# Altium schematic sheet STC智能车.SchDoc
size A2
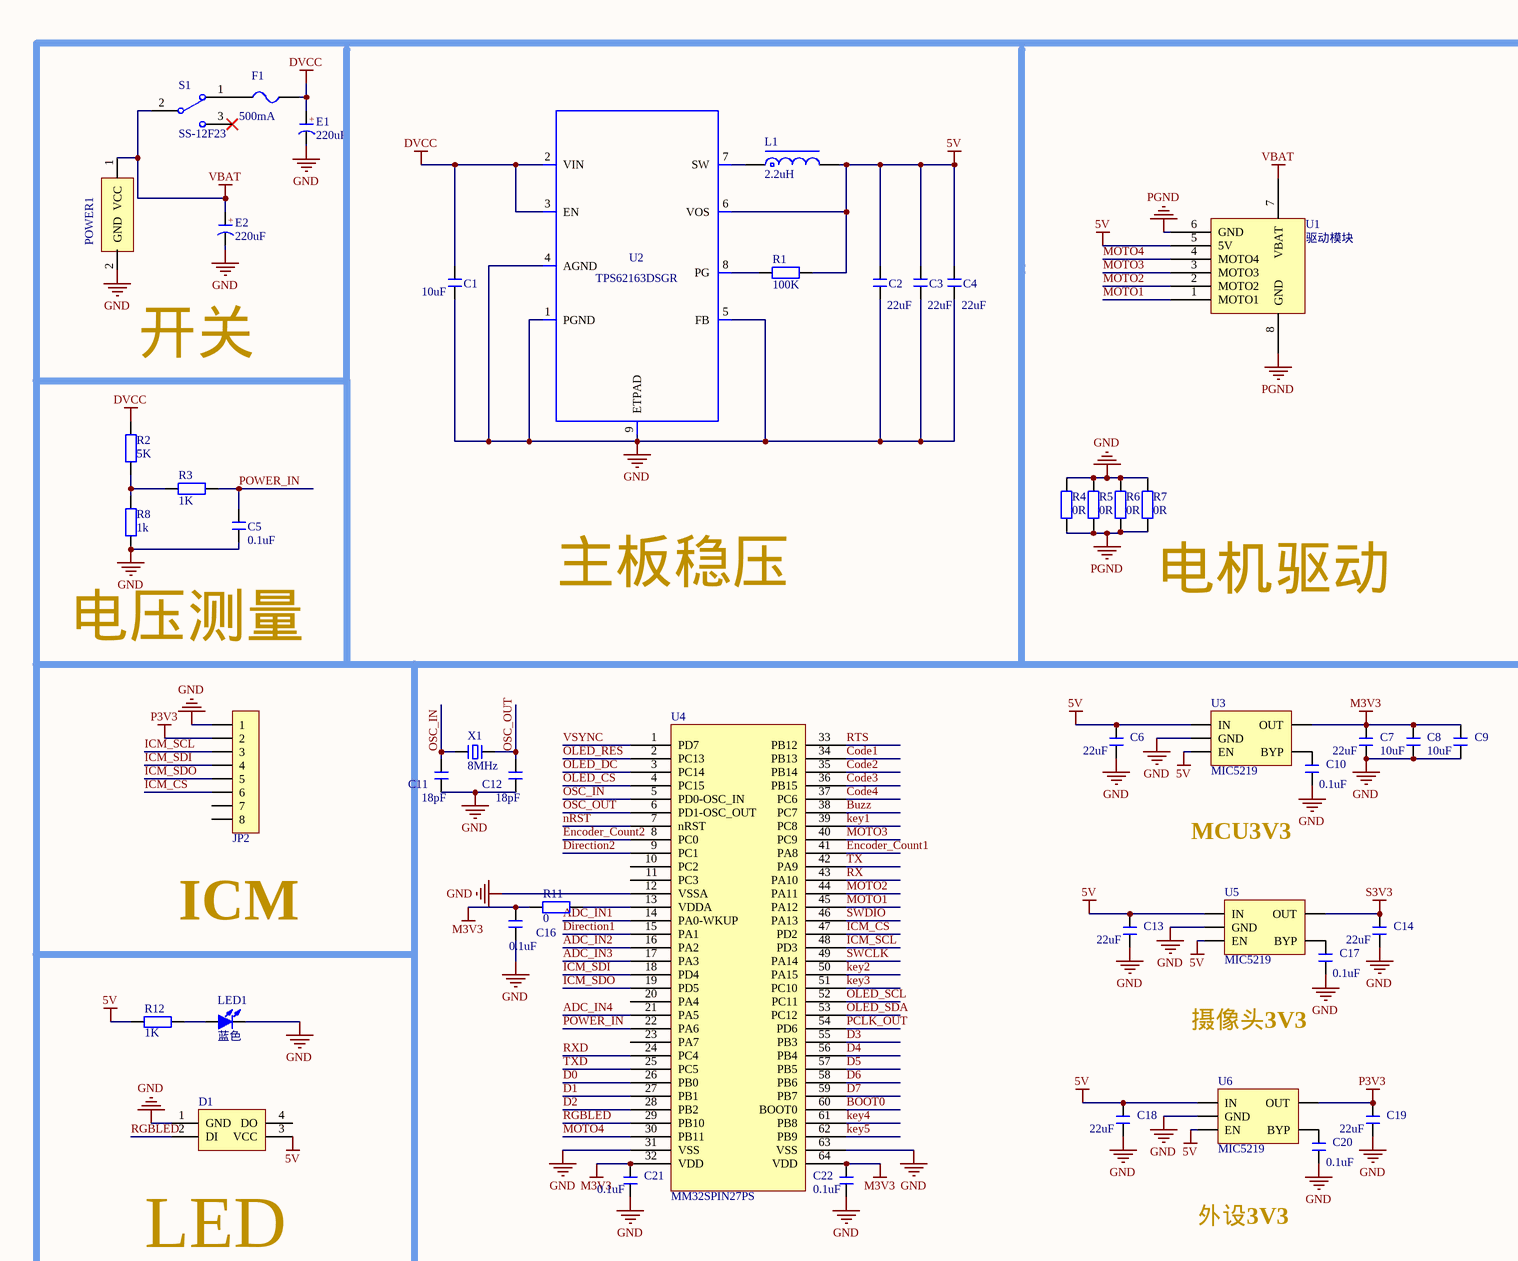
[diagram p0: STC智能车.SchDoc, top left]
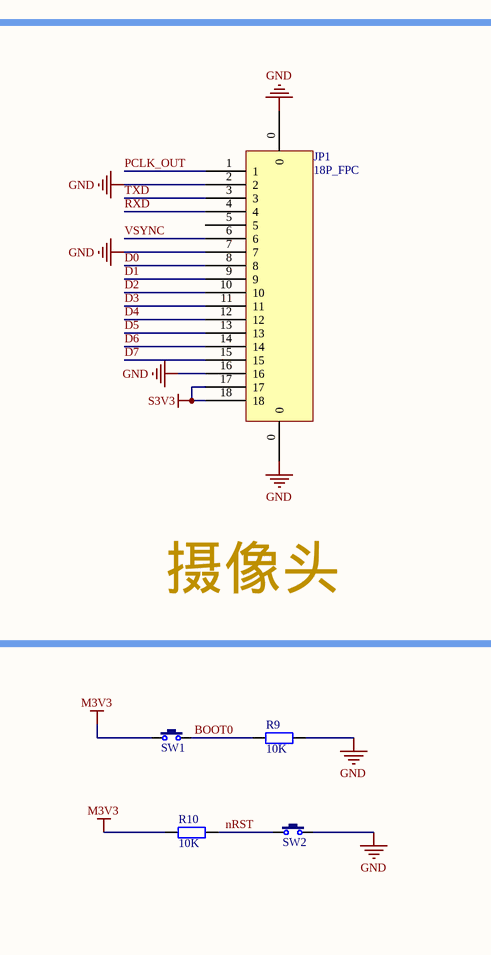
[diagram p1: STC智能车.SchDoc, top right]
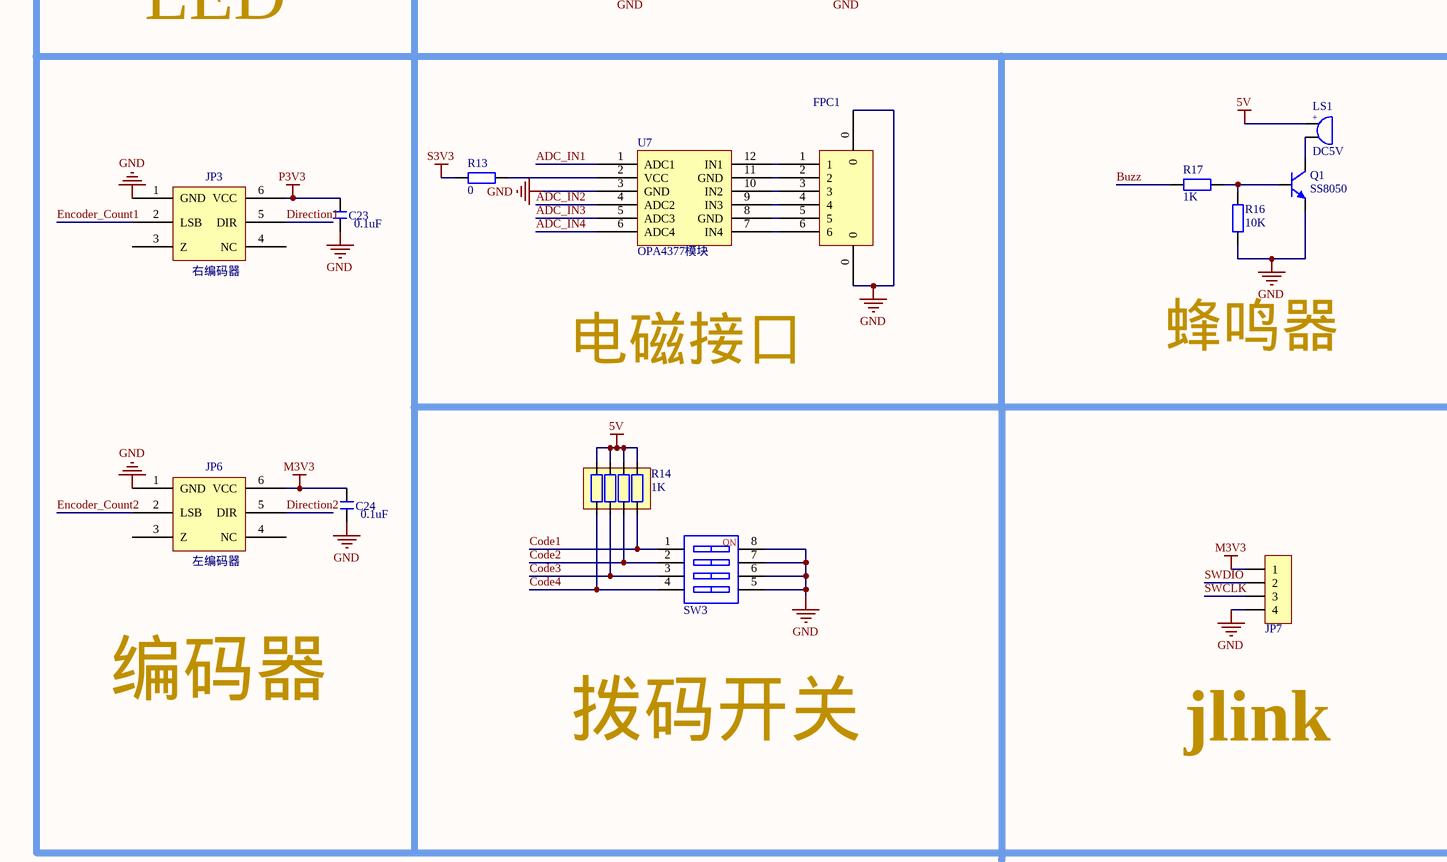
[diagram p2: STC智能车.SchDoc, bottom left]
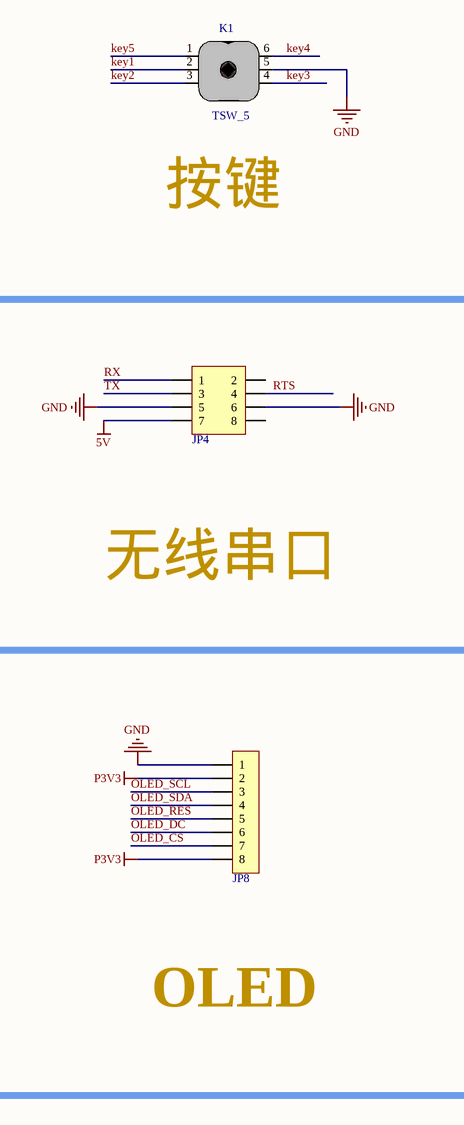
[diagram p3: STC智能车.SchDoc, bottom right]

## Parts
C1  10uF  [C 0805_M]
C2  22uF  [C 0805_M]
C3  22uF  [C 0805_M]
C4  22uF  [C 0805_M]
C5  0.1uF  [C 0805_M]
C6  22uF  [C 0805_M]
C7  22uF  [C 0805_M]
C8  10uF  [C 0805_M]
C9  10uF  [C 0805_M]
C10  0.1uF  [C 0805_M]
C11  18pF  [C 0805_M]
C12  18pF  [C 0805_M]
C13  22uF  [C 0805_M]
C14  22uF  [C 0805_M]
C16  0.1uF  [C 0805_M]
C17  0.1uF  [C 0805_M]
C18  22uF  [C 0805_M]
C19  22uF  [C 0805_M]
C20  0.1uF  [C 0805_M]
C21  0.1uF  [C 0805_M]
C22  0.1uF  [C 0805_M]
C23  0.1uF  [C 0805_M]
C24  0.1uF  [C 0805_M]
D1  P923D  [RGB_LED_5050]  (value not drawn)
E1  220uF  [CD D(7343)]
E2  220uF  [CD D(7343)]
F1  500mA  [FU 0805]
FPC1  FPC_6PIN  [FPC0.5 2H-WS-6P]  (value not drawn)
JP1  18P_FPC  [FPC0.5 2H-WS-18P]
JP2  HDR-1X8  [XH2.54-WI-8P]  (value not drawn)
JP3  右编码器  [2*3牛插座]
JP4  Header 4X2  [HDR2.54-LI-2x4P]  (value not drawn)
JP6  左编码器  [2*3牛插座]
JP7  HDR-1X4  [XH2.54-WI-4P]  (value not drawn)
JP8  HDR-1X8  [IPS]  (value not drawn)
K1  TSW_5  [TSW-10]
L1  2.2uH  [CD52]
LED1  蓝色  [LED 0805B]
LS1  DC5V  [BEEP 5x9x5.5]
POWER1  (no value)  [T槽]
Q1  SS8050  [SOT23-3N]
R1  value 100K  [R 0805_M]  (hidden comment: Res2)
R2  value 5K  [R 0805_M]  (hidden comment: Res2)
R3  value 1K  [R 0805_M]  (hidden comment: Res2)
R4  0R  [R 0805_M]
R5  0R  [R 0805_M]
R6  0R  [R 0805_M]
R7  0R  [R 0805_M]
R8  value 1k  [R 0805_M]  (hidden comment: Res2)
R9  10K  [R 0805_M]
R10  10K  [R 0805_M]
R11  0  [R 0805_M]
R12  value 1K  [R 0805_M]  (hidden comment: Res2)
R13  0  [R 0805_L]
R14  1K  [RCA-8P4R-0603]
R16  10K  [R 0805_L]
R17  1K  [R 0805_L]
S1  SS-12F23  [SS-12D10]
SW1  3x6x5  [TSW SMD-3*6*2.5]  (value not drawn)
SW2  3x6x5  [TSW SMD-3*6*2.5]  (value not drawn)
SW3  SW-4P  [CSW DIP-4P]  (value not drawn)
U1  驱动模块  [电机驱动]
U2  TPS62163DSGR  [TPS62163]
U3  MIC5219  [SOT23-5M]
U4  MM32SPIN27PS  [LQFP64 10x10_M]
U5  MIC5219  [SOT23-5M]
U6  MIC5219  [SOT23-5M]
U7  OPA4377模块  [OPA4377模块]
X1  8MHz  [OSC 5032-2P]

## Nets
5V: C2.2 C3.2 C4.2 C6.2 C13.2 C18.2 D1.3(VCC) JP4.7 L1.2 LS1.1 R1.1 R12.2 R14.5 R14.6 R14.7 R14.8 U1.5(5V) U2.6(VOS) U3.1(IN) U3.3(EN) U5.1(IN) U5.3(EN) U6.1(IN) U6.3(EN)
DVCC: C1.2 E1.1(A) F1.2 R2.2 U2.2(VIN) U2.3(EN)
GND: C1.1 C2.1 C3.1 C4.1 C5.1 C6.1 C7.1 C8.1 C9.1 C10.1 C11.1 C12.1 C13.1 C14.1 C16.1 C17.1 C18.1 C19.1 C20.1 C21.1 C22.1 C23.1 C24.1 D1.1(GND) E1.2(K) E2.2(K) FPC1.0 JP1.0 JP1.2 JP1.7 JP1.16 JP2.1 JP3.1(GND) JP4.5 JP4.6 JP6.1(GND) JP7.4 JP8.1 K1.5 LED1.2(K) POWER1.2(GND) Q1.2(E) R4.2 R5.2 R6.2 R7.2 R8.1 R9.2 R16.1 SW2.2 SW3.5 SW3.6 SW3.7 SW3.8 U2.1(PGND) U2.4(AGND) U2.5(FB) U2.9(ETPAD) U3.2(GND) U4.12(VSSA) U4.31(VSS) U4.63(VSS) U5.2(GND) U6.2(GND) U7.3(GND)
M3V3: C7.2 C8.2 C9.2 C16.2 C21.2 C22.2 C24.2 JP6.6(VCC) JP7.1 R10.1 R11.2 SW1.1 U3.5(OUT) U4.32(VDD) U4.64(VDD)
P3V3: C19.2 C23.2 JP2.2 JP3.6(VCC) JP8.2 JP8.8 U6.5(OUT)
PGND: R4.1 R5.1 R6.1 R7.1 U1.6(GND) U1.8(GND)
S3V3: C14.2 JP1.17 JP1.18 R13.1 U5.5(OUT)
VBAT: E2.1(A) POWER1.1(VCC) S1.2 U1.7(VBAT)
ADC_IN1: U4.14(PA0-WKUP) U7.1(ADC1)
ADC_IN2: U4.16(PA2) U7.4(ADC2)
ADC_IN3: U4.17(PA3) U7.5(ADC3)
ADC_IN4: U4.21(PA5) U7.6(ADC4)
BOOT0: R9.1 SW1.2 U4.60(BOOT0)
Buzz: R17.2 U4.38(PC7)
Code1: R14.4 SW3.1 U4.34(PB13)
Code2: R14.3 SW3.2 U4.35(PB14)
Code3: R14.2 SW3.3 U4.36(PB15)
Code4: R14.1 SW3.4 U4.37(PC6)
D0: JP1.8 U4.26(PB0)
D1: JP1.9 U4.27(PB1)
D2: JP1.10 U4.28(PB2)
D3: JP1.11 U4.55(PB3)
D4: JP1.12 U4.56(PB4)
D5: JP1.13 U4.57(PB5)
D6: JP1.14 U4.58(PB6)
D7: JP1.15 U4.59(PB7)
Direction1: JP3.5(DIR) U4.15(PA1)
Direction2: JP6.5(DIR) U4.9(PC1)
Encoder_Count1: JP3.2(LSB) U4.41(PA8)
Encoder_Count2: JP6.2(LSB) U4.8(PC0)
ICM_CS: JP2.6 U4.47(PD2)
ICM_SCL: JP2.3 U4.48(PD3)
ICM_SDI: JP2.4 U4.18(PD4)
ICM_SDO: JP2.5 U4.19(PD5)
key1: K1.2 U4.39(PC8)
key2: K1.3 U4.50(PA15)
key3: K1.4 U4.51(PC10)
key4: K1.6 U4.61(PB8)
key5: K1.1 U4.62(PB9)
MOTO1: U1.1(MOTO1) U4.45(PA12)
MOTO2: U1.2(MOTO2) U4.44(PA11)
MOTO3: U1.3(MOTO3) U4.40(PC9)
MOTO4: U1.4(MOTO4) U4.30(PB11)
nRST: R10.2 SW2.1 U4.7(nRST)
OLED_CS: JP8.7 U4.4(PC15)
OLED_DC: JP8.6 U4.3(PC14)
OLED_RES: JP8.5 U4.2(PC13)
OLED_SCL: JP8.3 U4.52(PC11)
OLED_SDA: JP8.4 U4.53(PC12)
OSC_IN: C11.2 U4.5(PD0-OSC_IN) X1.1
OSC_OUT: C12.2 U4.6(PD1-OSC_OUT) X1.2
PCLK_OUT: JP1.1 U4.54(PD6)
POWER_IN: C5.2 R3.1 U4.22(PA6)
RGBLED: D1.2(DI) U4.29(PB10)
RTS: JP4.4 U4.33(PB12)
RX: JP4.1 U4.43(PA10)
RXD: JP1.4 U4.24(PC4)
SWCLK: JP7.3 U4.49(PA14)
SWDIO: JP7.2 U4.46(PA13)
TX: JP4.3 U4.42(PA9)
TXD: JP1.3 U4.25(PC5)
VSYNC: JP1.6 U4.1(PD7)
NetC10_2: C10.2 U3.4(BYP)
NetC17_2: C17.2 U5.4(BYP)
NetC20_2: C20.2 U6.4(BYP)
NetF1_1: F1.1 S1.1
NetFPC1_1: FPC1.1 U7.12(IN1)
NetFPC1_2: FPC1.2 U7.11(GND)
NetFPC1_3: FPC1.3 U7.10(IN2)
NetFPC1_4: FPC1.4 U7.9(IN3)
NetFPC1_5: FPC1.5 U7.8(GND)
NetFPC1_6: FPC1.6 U7.7(IN4)
NetL1_1: L1.1 U2.7(SW)
NetLED1_1: LED1.1(A) R12.1
NetLS1_2: LS1.2 Q1.3(C)
NetQ1_1: Q1.1(B) R16.2 R17.1
NetR1_2: R1.2 U2.8(PG)
NetR2_1: R2.1 R3.2 R8.2
NetR11_1: R11.1 U4.13(VDDA)
NetR13_2: R13.2 U7.2(VCC)

Not connected (* = marked no-connect by the designer): D1 4(DO); JP1 5; JP2 7 8; JP3 3(Z) 4(NC); JP4 2 8; JP6 3(Z) 4(NC); S1 3*; U4 10(PC2) 11(PC3) 20(PA4) 23(PA7)

## Notes on the sheet
- 开关
- 主板稳压
- 电压测量
- (near R7) 电机驱动
- 摄像头
- MCU3V3
- (near JP2) ICM
- 摄像头3V3
- 按键
- (near D1) LED
- 外设3V3
- 电磁接口
- 蜂鸣器
- 无线串口
- 编码器
- 拨码开关
- jlink
- OLED
- (in symbol BEEP) +
- (in symbol CT) +
- (in symbol SW-4P) NO

## Library data of the parts
C1-C14 C16-C24 = C: 贴片电容; BOM名称: 无极性贴片电容; 淘宝ID: 封装库来自淘宝 ID：黄晶宝石; 联系售后: https://shop463601444.taobao.com
E1 E2 = CT: 贴片钽电容; 淘宝ID: 封装库来自淘宝 ID：黄晶宝石; BOM名称: 贴片钽电容; 联系售后: https://shop463601444.taobao.com
F1 = FU: 贴片保险丝; 版权归属: 源创客; BOM名称: 贴片保险丝; 学习资源: www.ooocke.com
JP2 JP8 = Header 8: 8P接插件; 版权归属: 封装库来自淘宝 ID：黄晶宝石; BOM名称: 8P接插件; 学习资源: https://shop463601444.taobao.com
JP3 JP6 = ENCODER
JP4 = Header 4X2: 4*2P接插件; 版权归属: 封装库来自淘宝 ID：黄晶宝石; BOM名称: 4*2P接插件; 学习资源: https://shop463601444.taobao.com
JP7 = Header 4: 4P接插件; 版权归属: 封装库来自淘宝 ID：黄晶宝石; BOM名称: 4P接插件; 学习资源: https://shop463601444.taobao.com
K1 = TSW_5: 方向开关
L1 = L-SMD: CD系列贴片线绕功率电感; BOM名称: 功率电感; 淘宝ID: 封装库来自淘宝 ID：黄晶宝石; 学习资源: www.ooocke.com
LED1 = LED-SMD: 贴片LED; 版权归属: 封装库来自淘宝 ID：黄晶宝石; BOM名称: 贴片LED; 学习资源: https://shop463601444.taobao.com
LS1 = BEEP: 蜂鸣器; 版权归属: 封装库来自淘宝 ID：黄晶宝石; BOM名称: 蜂鸣器; 联系售后: https://shop463601444.taobao.com
POWER1 = T槽
Q1 = 8050-SMD: 高频放大-NPN型; 版权归属: 封装库来自淘宝 ID：黄晶宝石; 属性: 40V 1.5A 1W 100MHZ; BOM名称: 高频放大-NPN型; 联系售后: https://shop463601444.taobao.com
R1-R3 R8 R12 = Res2: Resistor; Published: 8-Jun-2000; LatestRevisionDate: 17-Jul-2002; LatestRevisionNote: Re-released for DXP Platform.; PackageReference: AXIAL-0.4; Publisher: Altium Limited; PackageDescription: Axial Device, Thru-Hole; 2 Leads; 0.4 in Pin Spacing
R4-R7 R9-R11 = RES
R13 R16 R17 = R: 贴片电阻; 版权归属: 来自淘宝 ID：黄晶宝石; BOM名称: 贴片电阻; 联系售后: https://shop463601444.taobao.com
R14 = R-8P4R: 贴片排阻; BOM名称: 贴片网络排阻; 版权归属: 封装库来自淘宝 ID：黄晶宝石; 联系售后: https://shop463601444.taobao.com
S1 = SSW-1P: 1路波动开关; BOM名称: 波动开关; 版权归属: 封装库来自淘宝 ID：黄晶宝石; 学习资源: www.ooocke.com
SW1 SW2 = TSW 3x6: 3x6轻触开关; 版权归属: 封装库来自淘宝 ID：黄晶宝石; BOM名称: 3x6轻触开关; 学习资源: www.ooocke.com
SW3 = SW-4P: 4路编码开关; 淘宝ID: 封装库来自淘宝 ID：黄晶宝石; BOM名称: 4路编码开关; 学习资源: https://shop463601444.taobao.com
U2 = TPS62163DSGR: Manufacturer Name: Texas Instruments; PackageReference: TPS62163DSGR; Manufacturer Part Number: TPS62163DSGR; Value: N/A
X1 = XTAL-2P: 2脚无源脚晶振; 版权归属: 源创客; BOM名称: 2脚无源脚晶振; 学习资源: www.ooocke.com
D1 = P923D: Publisher: mazhongwei; Published: 8-August-2017; PackageReference: RGB_LED_5050